# Altium schematic sheet Sheet2.SchDoc
size A3; DocumentNumber: 2; SheetNumber: 2; SheetTotal: 2
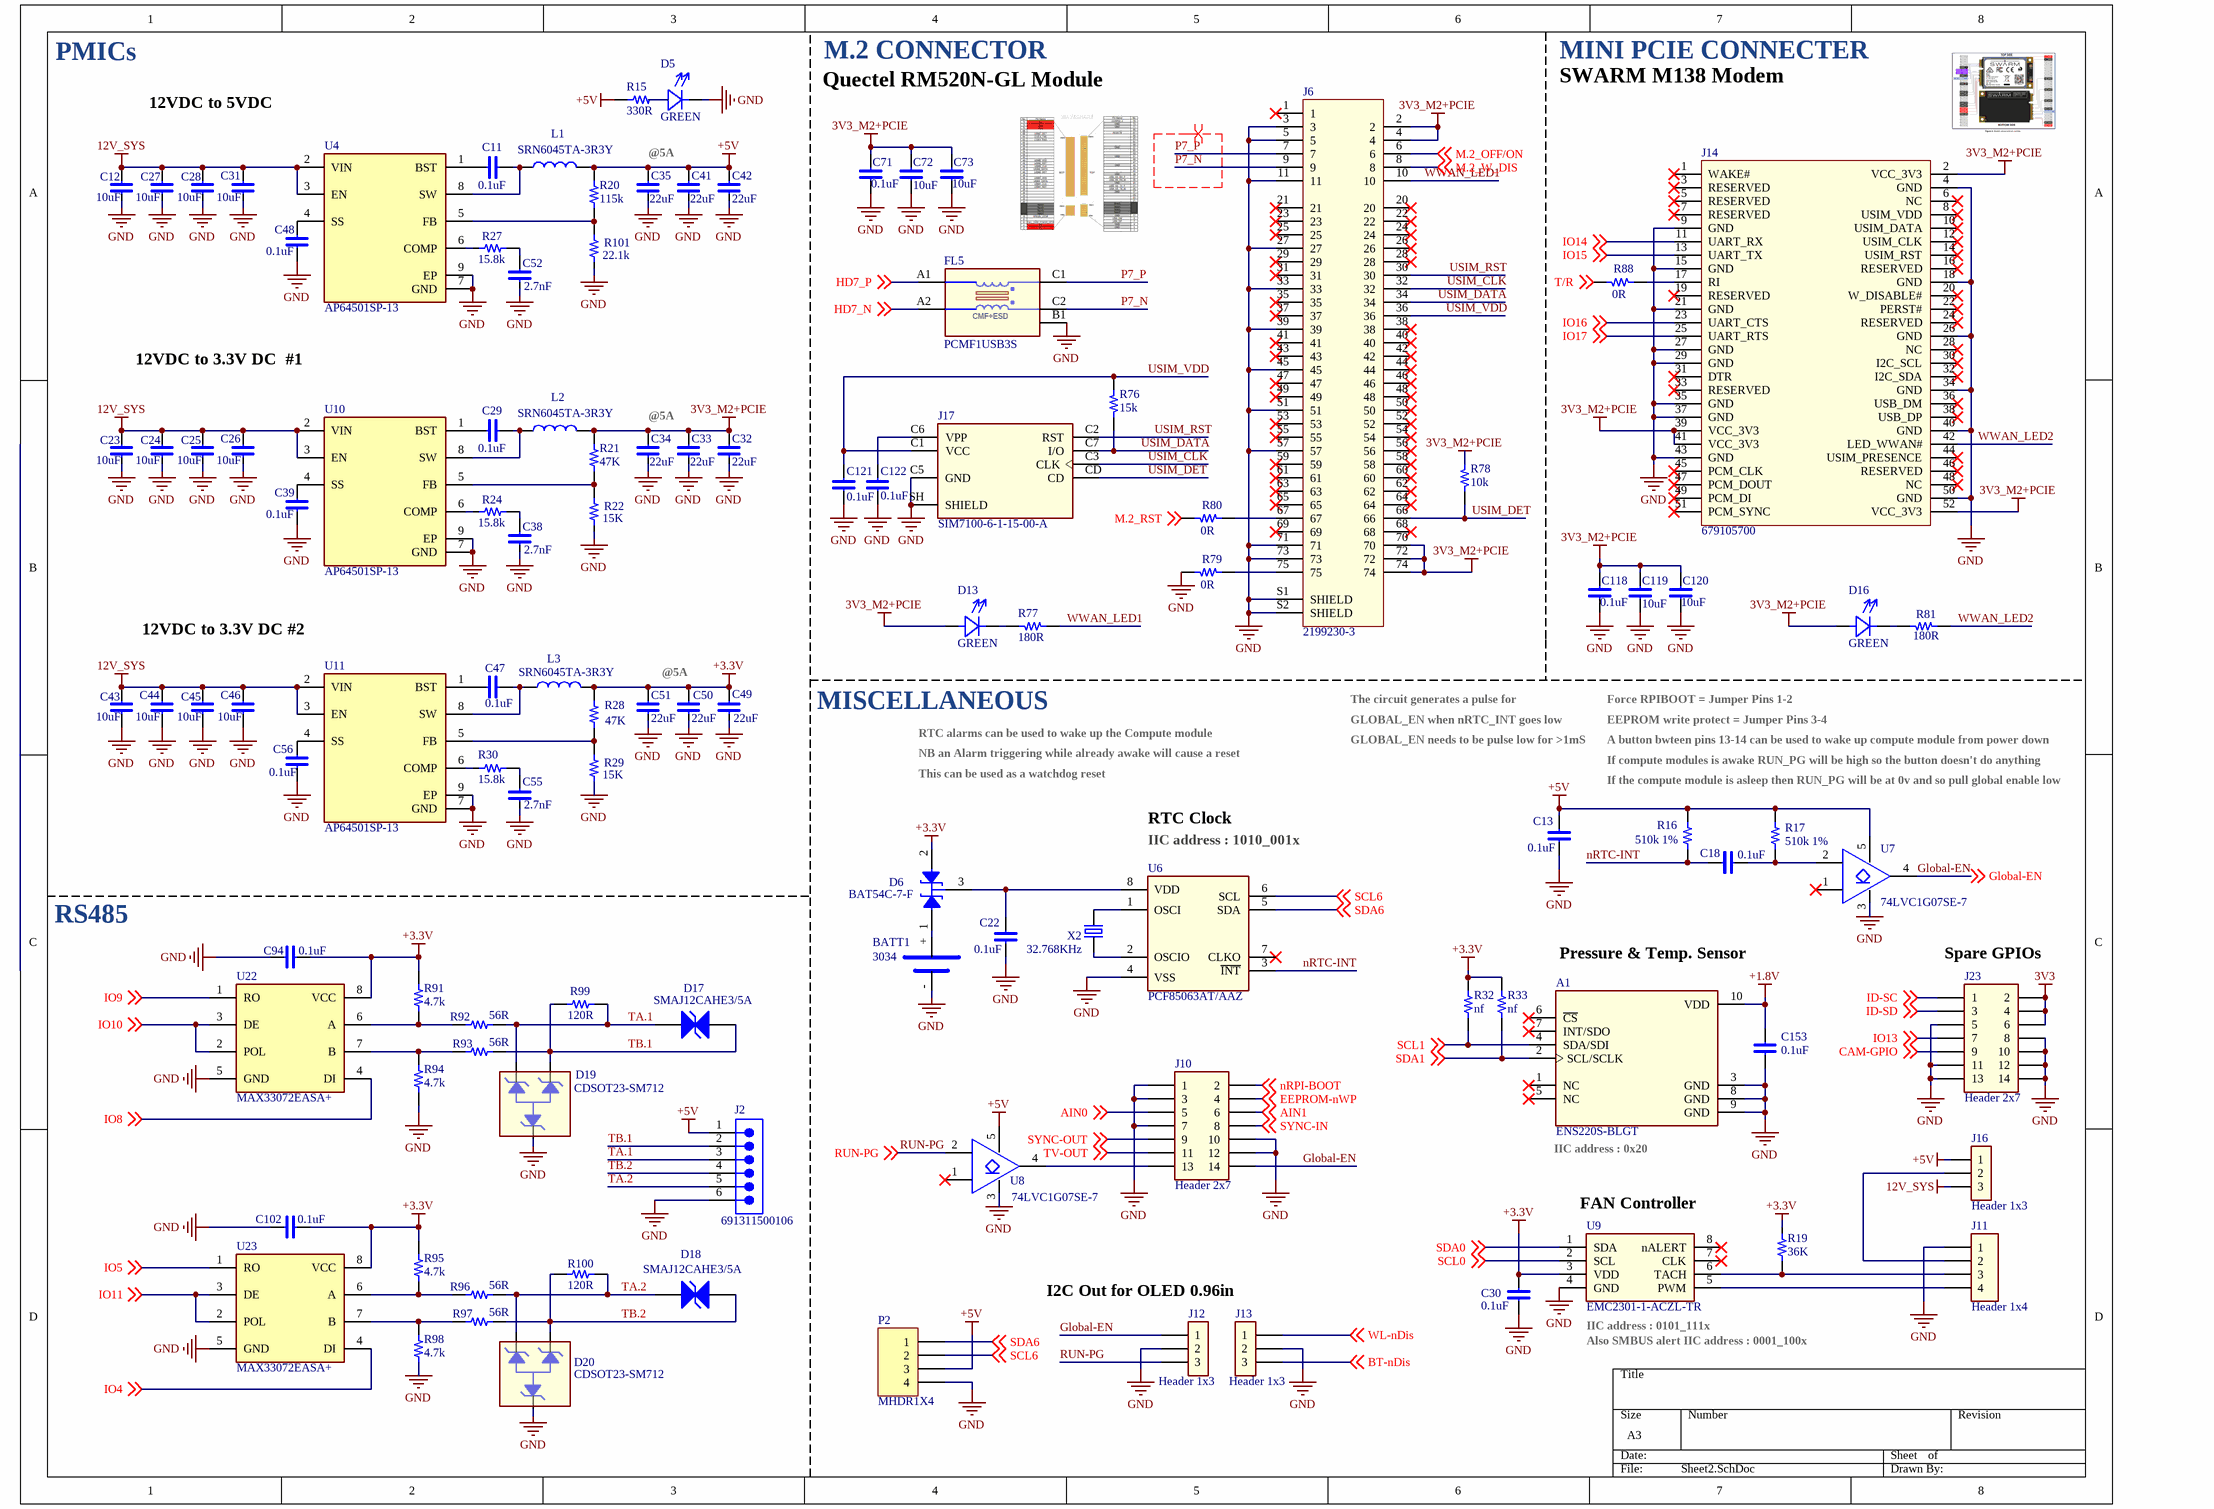
[diagram p0: Sheet2.SchDoc]

## Parts
A1  ENS220S-BLGT  [XDCR_ENS220S-BLGT]
BATT1  3034  [Keystone-3034]
C11  0.1uF  [C-0402/1005]
C12  10uF  [C-0805/2012]
C13  0.1uF  [C-0402/1005]
C18  0.1uF  [C-0402/1005]
C22  0.1uF  [C-0402/1005]
C23  10uF  [C-0805/2012]
C24  10uF  [C-0805/2012]
C25  10uF  [C-0805/2012]
C26  10uF  [C-0805/2012]
C27  10uF  [C-0805/2012]
C28  10uF  [C-0805/2012]
C29  0.1uF  [C-0402/1005]
C30  0.1uF  [C-0402/1005]
C31  10uF  [C-0805/2012]
C32  22uF  [C-0805/2012]
C33  22uF  [C-0805/2012]
C34  22uF  [C-0805/2012]
C35  22uF  [C-0805/2012]
C38  2.7nF  [C-0402/1005]
C39  0.1uF  [C-0402/1005]
C41  22uF  [C-0805/2012]
C42  22uF  [C-0805/2012]
C43  10uF  [C-0805/2012]
C44  10uF  [C-0805/2012]
C45  10uF  [C-0805/2012]
C46  10uF  [C-0805/2012]
C47  0.1uF  [C-0402/1005]
C48  0.1uF  [C-0402/1005]
C49  22uF  [C-0805/2012]
C50  22uF  [C-0805/2012]
C51  22uF  [C-0805/2012]
C52  2.7nF  [C-0402/1005]
C55  2.7nF  [C-0402/1005]
C56  0.1uF  [C-0402/1005]
C71  0.1uF  [C-0402/1005]
C72  10uF  [C-0603/1608]
C73  10uF  [C-0603/1608]
C94  0.1uF  [C-0402/1005]
C102  0.1uF  [C-0402/1005]
C118  0.1uF  [C-0402/1005]
C119  10uF  [C-0603/1608]
C120  10uF  [C-0603/1608]
C121  0.1uF  [C-0402/1005]
C122  0.1uF  [C-0402/1005]
C153  0.1uF  [C-0402/1005]
D5  GREEN  [LED-0603-Green]
D6  BAT54C-7-F  [SOT-23-3]
D13  GREEN  [LED-0402-GREEN]
D16  GREEN  [LED-0402-GREEN]
D17  SMAJ12CAHE3/5A  [VISH-DO-214AC-2_L]
D18  SMAJ12CAHE3/5A  [VISH-DO-214AC-2_L]
D19  CDSOT23-SM712  [SOT-23-3]
D20  CDSOT23-SM712  [SOT-23-3]
FL5  PCMF1USB3S  [WLCSP5(2-1-2)_NEX]
J2  691311500106  [691311500106]
J6  2199230-3  [TE_2199230-3]
J10  Header 2x7  [PIN HEADER 2x7 2.54mm]
J11  Header 1x4  [PIN HEADER 1x4 2.54mm]
J12  Header 1x3  [PIN HEADER 1x3 2.54mm]
J13  Header 1x3  [PIN HEADER 1x3 2.54mm]
J14  679105700  [679105700-A]
J16  Header 1x3  [PIN HEADER 1x3 2.54mm]
J17  SIM7100-6-1-15-00-A  [GCT_SIM7100-6-1-15-00-A_REVC]
J23  Header 2x7  [PIN HEADER 2x7 2.54mm]
L1  SRN6045TA-3R3Y  [IND_SRN6045TA-3R3Y]
L2  SRN6045TA-3R3Y  [IND_SRN6045TA-3R3Y]
L3  SRN6045TA-3R3Y  [IND_SRN6045TA-3R3Y]
P2  MHDR1X4  [PIN HEADER 1x4 2.54mm]
R15  330R  [R-0402/1005]
R16  510k 1%  [R-0402/1005]
R17  510k 1%  [R-0402/1005]
R19  36K  [R-0402/1005]
R20  115k  [R-0402/1005]
R21  47K  [R-0402/1005]
R22  15K  [R-0402/1005]
R24  15.8k  [R-0402/1005]
R27  15.8k  [R-0402/1005]
R28  47K  [R-0402/1005]
R29  15K  [R-0402/1005]
R30  15.8k  [R-0402/1005]
R32  nf  [R-0402/1005]
R33  nf  [R-0402/1005]
R76  15k  [R-0402/1005]
R77  180R  [R-0402/1005]
R78  10k  [R-0402/1005]
R79  0R  [R-0402/1005]
R80  0R  [R-0402/1005]
R81  180R  [R-0402/1005]
R88  0R  [R-0402/1005]
R91  4.7k  [R-0402/1005]
R92  56R  [R-0402/1005]
R93  56R  [R-0402/1005]
R94  4.7k  [R-0402/1005]
R95  4.7k  [R-0402/1005]
R96  56R  [R-0402/1005]
R97  56R  [R-0402/1005]
R98  4.7k  [R-0402/1005]
R99  120R  [R-0402/1005]
R100  120R  [R-0402/1005]
R101  22.1k  [R-0402/1005]
U4  AP64501SP-13  [FP-SO-8EP-IPC_A]
U6  PCF85063AT/AAZ  [SOIC-8 (W3.9mm)]
U7  74LVC1G07SE-7  [SOT-353]
U8  74LVC1G07SE-7  [SOT-353]
U9  EMC2301-1-ACZL-TR  [SOP65P490X110-8N]
U10  AP64501SP-13  [FP-SO-8EP-IPC_A]
U11  AP64501SP-13  [FP-SO-8EP-IPC_A]
U22  MAX33072EASA+  [FP-S8-4-IPC_B]
U23  MAX33072EASA+  [FP-S8-4-IPC_B]
X2  32.768KHz  [XTAL3215]

## Nets
3V3: J23.2 J23.4 J23.6
3V3_M2+PCIE: C32.1 C33.1 C34.1 C71.1 C72.1 C73.1 C118.1 C119.1 C120.1 D13.1(A) D16.1(A) J6.2 J6.4 J6.70 J6.72 J6.74 J14.2(VCC_3V3) J14.39(VCC_3V3) J14.41(VCC_3V3) J14.52(VCC_3V3) L2.1 R21.1 R78.2
12V_SYS: C12.1 C23.1 C24.1 C25.1 C26.1 C27.1 C28.1 C31.1 C43.1 C44.1 C45.1 C46.1 J16.3 U4.2(VIN) U4.3(EN) U10.2(VIN) U10.3(EN) U11.2(VIN) U11.3(EN)
+1.8V: A1.10(VDD) C153.1
+3.3V: C30.1 C49.1 C50.1 C51.1 C94.2 C102.2 D6.2 L3.1 R19.1 R28.1 R32.1 R33.1 R91.2 R95.2 U9.3(VDD) U22.8(VCC) U23.8(VCC)
+5V: C13.1 C35.1 C41.1 C42.1 J2.1 J16.1 L1.1 P2.3 R15.2 R16.2 R17.2 R20.1 U7.5 U8.5
GND: A1.3(GND) A1.8(GND) A1.9(GND) BATT1.-(_) C12.2 C13.2 C22.2 C23.2 C24.2 C25.2 C26.2 C27.2 C28.2 C30.2 C31.2 C32.2 C33.2 C34.2 C35.2 C38.2 C39.2 C41.2 C42.2 C43.2 C44.2 C45.2 C46.2 C48.2 C49.2 C50.2 C51.2 C52.2 C55.2 C56.2 C71.2 C72.2 C73.2 C94.1 C102.1 C118.2 C119.2 C120.2 C121.2 C122.2 C153.2 D5.2 D19.3 D20.3 FL5.B1(GND) J2.6 J6.3 J6.5 J6.11 J6.27 J6.33 J6.39 J6.45 J6.51 J6.57 J6.71 J6.73 J6.S1(SHIELD) J6.S2(SHIELD) J10.1 J10.3 J10.7 J10.10 J10.12 J11.1 J12.2 J13.2 J14.4(GND) J14.9(GND) J14.15(GND) J14.18(GND) J14.21(GND) J14.26(GND) J14.27(GND) J14.29(GND) J14.34(GND) J14.35(GND) J14.37(GND) J14.40(GND) J14.43(GND) J14.50(GND) J17.C5(GND) J17.SH(SHIELD) J23.5 J23.8 J23.10 J23.11 J23.12 J23.13 J23.14 P2.4 R22.2 R29.2 R79.2 R94.2 R98.2 R101.2 U4.7(GND) U4.9(EP) U6.4(VSS) U7.3 U8.3 U9.4(GND) U10.7(GND) U10.9(EP) U11.7(GND) U11.9(EP) U22.5(GND) U23.5(GND)
AIN0: J10.5 ; off-sheet AIN0
AIN1: J10.6 ; off-sheet AIN1
BT-nDis: J13.3 ; off-sheet BT-nDis
CAM-GPIO: J23.9 ; off-sheet CAM-GPIO
EEPROM-nWP: J10.4 ; off-sheet EEPROM-nWP
Global-EN: J10.14 J12.1 U7.4 ; off-sheet Global-EN
HD7_N: FL5.A2(CH1_IN-) ; off-sheet HD7_N
HD7_P: FL5.A1(CH1_IN+) ; off-sheet HD7_P
ID-SC: J23.1 ; off-sheet ID-SC
ID-SD: J23.3 ; off-sheet ID-SD
IO4: U23.4(DI) ; off-sheet IO4
IO5: U23.1(RO) ; off-sheet IO5
IO8: U22.4(DI) ; off-sheet IO8
IO9: U22.1(RO) ; off-sheet IO9
IO10: U22.2(POL) U22.3(DE) ; off-sheet IO10
IO11: U23.2(POL) U23.3(DE) ; off-sheet IO11
IO13: J23.7 ; off-sheet IO13
IO14: J14.11(UART_RX) ; off-sheet IO14
IO15: J14.13(UART_TX) ; off-sheet IO15
IO16: J14.23(UART_CTS) ; off-sheet IO16
IO17: J14.25(UART_RTS) ; off-sheet IO17
M.2_OFF/ON: J6.6 ; off-sheet M.2_OFF/ON
M.2_RST: R80.2 ; off-sheet M.2_RST
M.2_W_DIS: J6.8 ; off-sheet M.2_W_DIS
nRPI-BOOT: J10.2 ; off-sheet nRPI-BOOT
nRTC-INT: C18.1 R16.1 U6.3(~{INT})
P7_N: FL5.C2(CH1_OUT-) J6.9
P7_P: FL5.C1(CH1_OUT+) J6.7
RUN-PG: J12.3 U8.2 ; off-sheet RUN-PG
SCL0: U9.2(SCL) ; off-sheet SCL0
SCL1: A1.4(SDA/SDI) R32.2 ; off-sheet SCL1
SCL6: P2.2 U6.6(SCL) ; off-sheet SCL6
SDA0: U9.1(SDA) ; off-sheet SDA0
SDA1: A1.2(SCL/SCLK) R33.2 ; off-sheet SDA1
SDA6: P2.1 U6.5(SDA) ; off-sheet SDA6
SYNC-IN: J10.8 ; off-sheet SYNC-IN
SYNC-OUT: J10.9 ; off-sheet SYNC-OUT
T/R: R88.2 ; off-sheet T/R
TA.1: D17.1(A1) D19.1 J2.3 R92.2 R99.1
TA.2: D18.1(A1) D20.1 J2.5 R96.2 R100.1
TB.1: D17.2(A2) D19.2 J2.2 R93.2 R99.2
TB.2: D18.2(A2) D20.2 J2.4 R97.2 R100.2
TV-OUT: J10.11 ; off-sheet TV-OUT
USIM_CLK: J6.32 J17.C3(CLK)
USIM_DATA: J6.34 J17.C7(I/O) R76.1
USIM_DET: J6.66 J17.CD R78.1
USIM_RST: J6.30 J17.C2(RST)
USIM_VDD: C121.1 J6.36 J17.C1(VCC) R76.2
WL-nDis: J13.1 ; off-sheet WL-nDis
WWAN_LED1: J6.10 R77.1
WWAN_LED2: J14.42(LED_WWAN#) R81.1
NetBATT1_+: BATT1.+ D6.1
NetC11_1: C11.1 L1.2 U4.8(SW)
NetC11_2: C11.2 U4.1(BST)
NetC18_2: C18.2 R17.1 U7.2
NetC22_1: C22.1 D6.3 U6.8(VDD)
NetC29_1: C29.1 L2.2 U10.8(SW)
NetC29_2: C29.2 U10.1(BST)
NetC38_1: C38.1 R24.2
NetC39_1: C39.1 U10.4(SS)
NetC47_1: C47.1 L3.2 U11.8(SW)
NetC47_2: C47.2 U11.1(BST)
NetC48_1: C48.1 U4.4(SS)
NetC52_1: C52.1 R27.2
NetC55_1: C55.1 R30.2
NetC56_1: C56.1 U11.4(SS)
NetC122_1: C122.1 J17.C6(VPP)
NetD5_1: D5.1 R15.1
NetD13_2: D13.2(C) R77.2
NetD16_2: D16.2(C) R81.2
NetJ6_67: J6.67 R80.1
NetJ6_75: J6.75 R79.1
NetJ10_13: J10.13 U8.4
NetJ11_2: J11.2 J16.2
NetJ11_3: J11.3 R19.2 U9.6(TACH)
NetJ11_4: J11.4 U9.5(PWM)
NetJ14_17: J14.17(RI) R88.1
NetR20_2: R20.2 R101.1 U4.5(FB)
NetR21_2: R21.2 R22.1 U10.5(FB)
NetR24_1: R24.1 U10.6(COMP)
NetR27_1: R27.1 U4.6(COMP)
NetR28_2: R28.2 R29.1 U11.5(FB)
NetR30_1: R30.1 U11.6(COMP)
NetR91_1: R91.1 R92.1 U22.6(A)
NetR93_1: R93.1 R94.1 U22.7(B)
NetR95_1: R95.1 R96.1 U23.6(A)
NetR97_1: R97.1 R98.1 U23.7(B)
NetU6_1: U6.1(OSCI) X2.2
NetU6_2: U6.2(OSCIO) X2.1

Not connected (* = marked no-connect by the designer): A1 1(NC)* 5(NC)* 6(~{CS})* 7(INT/SDO)*; J6 1* 20* 21* 22* 23* 24* 25* 26* 28* 29* 31* 35* 37* 38* 40* 41* 42* 43* 44* 46* 47* 48* 49* 50* 52* 53* 54* 55* 56* 58* 59* 60* 61* 62* 63* 64* 65* 68* 69*; J14 1(WAKE#)* 3(RESERVED)* 5(RESERVED)* 6(NC)* 7(RESERVED)* 8(USIM_VDD)* 10(USIM_DATA)* 12(USIM_CLK)* 14(USIM_RST)* 16(RESERVED)* 19(RESERVED)* 20(W_DISABLE#)* 22(PERST#)* 24(RESERVED)* 28(NC)* 30(I2C_SCL)* 31(DTR)* 32(I2C_SDA)* 33(RESERVED)* 36(USB_DM)* 38(USB_DP)* 44(USIM_PRESENCE)* 45(PCM_CLK)* 46(RESERVED)* 47(PCM_DOUT)* 48(NC)* 49(PCM_DI)* 51(PCM_SYNC)*; U6 7(CLKO)*; U7 1*; U8 1*; U9 7(CLK)* 8(nALERT)*

## Layout directives
differential pair; differential pair class 90OHM: P7_N, P7_P

## Notes on the sheet
- PMICs
- 12VDC to 5VDC
- Quectel RM520N-GL Module
- M.2 CONNECTOR
- MINI PCIE CONNECTER
- SWARM M138 Modem
- @5A
- 12VDC to 3.3V DC  #1
- 12VDC to 3.3V DC #2
- MISCELLANEOUS
- The circuit generates a pulse for
- GLOBAL_EN when nRTC_INT goes low
- Force RPIBOOT = Jumper Pins 1-2
- EEPROM write protect = Jumper Pins 3-4
- RTC alarms can be used to wake up the Compute module
- NB an Alarm triggering while already awake will cause a reset
- This can be used as a watchdog reset
- GLOBAL_EN needs to be pulse low for >1mS
- A button bwteen pins 13-14 can be used to wake up compute module from power down
- If compute modules is awake RUN_PG will be high so the button doesn't do anything
- If the compute module is asleep then RUN_PG will be at 0v and so pull global enable low
- (near U6) IIC address : 1010_001x
- RTC Clock
- RS485
- Pressure & Temp. Sensor
- (near J23) Spare GPIOs
- (near A1) IIC address : 0x20
- (near U9) FAN Controller
- (near P2) I2C Out for OLED 0.96in
- (near U9) IIC address : 0101_111x
- Also SMBUS alert IIC address : 0001_100x
- (in symbol Nexperia, PCMF1USB3SZ) CMF+ESD

## Library data of the parts
A1 = ENS220S-BLGT: Board Mount Pressure Sensors ENS220S-BLGT LGA10 T&R 3K5 - Premium accuracy barometric pressureand temperature sensor for activitytracking and indoor navigation /localization; MF: ScioSense; SnapEDA_Link: https://www.snapeda.com/parts/ENS220S-BLGT/ScioSense/view-part/?ref=snap; Package: None; Value: *; MP: ENS220S-BLGT; Check_prices: https://www.snapeda.com/parts/ENS220S-BLGT/ScioSense/view-part/?ref=eda
BATT1 = Coin-Cell: BATTERY RETAINER COIN 20MM SMD; Unit Price (USD): 0.33; Mfr. Part No.: 3034; Supplier: Digikey Electronics; Supplier Part No.: 36-3034-ND
C11 C12 C23-C35 C38 C39 C41-C52 C55 C56 = CAP 1206/3216: CAP CER 10UF 25V X5R 1206; Mfr. Part No.: C1206C106M3PACTU; Unit Price (USD): 0.28; Supplier Part No.: 399-8153-1-ND; Supplier: Digikey Electronics
C13 C18 C22 C121 C122 C153 = Capacitor-NonPolar: CAP CER 0.1UF 16V X7R 0402; Mfr. Part No.: GCM155R71C104KA55D; Unit Price (USD): 0.1; Value: 0.1uF 16V; Supplier Part No.: 490-4759-1-ND; Supplier: Digikey Electronics
C71-C73 C94 C102 C118-C120 = Capacitor-NonPolar: CAP CER 0.1UF 50V X7R 0402; Mfr. Part No.: UMK105B7104KV-FR; Value: 100nF; Unit Price (USD): 0.15; Supplier Part No.: 587-3498-1-ND; Supplier: Digikey Electronics
D5 D13 D16 = Diode-LED: Supplier: Digikey Electronics
D6 = BAT54C-7-F: DIODE ARRAY SCHOTTKY 30V SOT23-3; Unit Price (USD): 0.18; Supplier Part No.: BAT54C-FDICT-ND; Mfr. Part No.: BAT54C-7-F; Supplier: Digikey Electronics
D17 D18 = CMP-0548-00111-2: Transient Voltage Suppressor, 6.40 to 231 V, 12 V Stand-off Voltage, Bi-Directional, -55 to 155 degC, 2-pin DO-214AC, Pb-Free, Tape and Reel; Manufacturer: Vishay Semiconductor; ID (uA): 2; IFSM: 40 A; VBR Bi-Directional (V): 6.4 to 231; VWM (V): 12; PPPM (W): 400, 300; ComponentLink1Description: Manufacturer URL; ComponentLink3Description: Package Specification; ComponentLink3URL: http://www.vishay.com/docs/88390/smaj50a.pdf; RoHS: TRUE; PackageDescription: 2-Pin DO-214AC (SMA), Body 4.245 x 2.665 mm; Packing: Tape and Reel; Operating Junction and Storage Temperature Range: -55 to 150 degC; ComponentLink2Description: Datasheet; PartNumber: SMAJ12CAHE3/5A; PackageReference: DO-214AC-2; ComponentLink2URL: http://www.vishay.com/docs/88390/smaj50a.pdf; DatasheetVersion: 12/8/2013; Mounting Technology: Surface Mount; ComponentLink1URL: http://www.vishay.com/
D19 D20 = RCLAMP3552T: TVS DIODE 3.5V 6.5V SLP1006N3T; Mfr. Part No.: RCLAMP3552T.TNT; Unit Price (USD): 0.48; Supplier Part No.: RCLAMP3552T.TNTCT-ND; Supplier: Digikey Electronics
FL5 = Nexperia, PCMF1USB3SZ: FLT, SMT, WLCSP5, Common Mode EMI Filters; Supply Voltage: NO; Notes: NC; Value: PCMF1USB3S; Manufacturer: Nexperia; Mounting: SMT; Operating Temperature: -40ºC ~ +125ºC; Subpart Type: Common Mode EMI Filters; Footprint: WLCSP5; Manufacturer Part Number: PCMF1USB3S; Datasheet Link: https://www.nexperia.com/products/esd-protection-tvs-filtering-and-signal-conditioning/emi-solutions-with-integrated-protection/common-mode-filters-with-integrated-protection/PCMF1USB3S.html; Supply Current: NO; Substitutes Allowed: NO; Height: 0.6mm
J2 = CMP-1502-02150-2: NexarPartId: 8917751; Gender: Male; Number of Contacts: 6; Number of Levels: 1; Pitch: 5.08mm; Current: 20A; Voltage: 300V; RoHS: Compliant; Height: 12mm; Termination: Solder; Packaging: Box; Orientation: Vertical; Lead Pitch: 5.08mm; Mount: Through Hole; Length: 8.5mm; Contact Plating: Tin; Number of Rows: 1; Width: 32.48mm; Contact Material: Brass; Number of Pins: 6; Color: Green; Number of Positions Per Level: 6; REACH SVHC: Unknown
J6 = 2199230-3: M.2 0.5PITCH 4.2H KEY B 15U'' AU; Package: None; MP: 2199230-3; Value: *; Availability: Unavailable; Price: None
J10 J23 = Header 2x7: CONN HEADER VERT 14POS 2.54MM; Mfr. Part No.: PRPC007DFBN-RC; Unit Price (USD): 0.47; Supplier Part No.: S2221EC-07-ND; Supplier: Digikey Electronics
J11 = Header 1x4: CONN HEADER VERT 4POS 2.54MM; Supplier: Digikey Electronics
J12 J13 J16 = Header 1x3: CONN HEADER VERT 3POS 2.54MM; Mfr. Part No.: 75160-156-03LF; Value: 51R; Unit Price (USD): 0.74; Supplier Part No.: 609-75160-156-03LF-ND; Supplier: Digikey Electronics
J14 U9 = Component_1
J17 = SIM7100-6-1-15-00-A_REVC: 7 _6 + 1_ Position Card Connector Micro SIM Surface Mount, Right Angle Gold; MF: Global Connector Technology; Package: None; Availability: Unavailable; SnapEDA_Link: https://www.snapeda.com/parts/SIM7100-6-1-15-00-A/Global%20Connector%20Technology/view-part/449163/?ref=snap; MP: SIM7100-6-1-15-00-A; Price: None; Value: *
L1-L3 = 4.3x4.3mm: FIXED IND 22UH 620MA 350 MOHM; Mfr. Part No.: ASPI-4020S-220M-T; Unit Price (USD): 0.48; Supplier Part No.: 535-12307-1-ND; Value: 22uH; Supplier: Digikey Electronics
P2 = MHDR1X4: Header, 4-Pin; LatestRevisionDate: 17-Jul-2002; LatestRevisionNote: Re-released for DXP Platform.; Publisher: Altium Limited
R15 R19-R22 R24 R27-R30 R76-R81 R88 R91-R101 = Resistor: RES SMD 51 OHM 0.5% 1/16W 0402; Mfr. Part No.: ERA-2AED510X; Value: 51R; Unit Price (USD): 0.21; Supplier Part No.: P51DECT-ND; Supplier: Digikey Electronics
R16 R17 = Resistor: RES SMD 510K OHM 1% 1/16W 0402; Mfr. Part No.: MCR01MZPF5103; Unit Price (USD): 0.1; Value: 510k 1%; Supplier Part No.: RHM510KLCT-ND; Supplier: Digikey Electronics
R32 R33 = Resistor: RES SMD 1K OHM 1% 1/16W 0402; Mfr. Part No.: RC0402FR-071KL; Unit Price (USD): 0.1; Value: 1k; Supplier Part No.: 311-1.00KLRCT-ND; Supplier: Digikey Electronics
U4 U10 U11 = CMP-12757-000024-1: DCDC CONV HV BUCK SO-8EP
U6 = PCF85063AT/AAZ: IC RTC CLK/CALENDAR I2C 8SOIC; Unit Price (USD): 0.335; Mfr. Part No.: PCF85063AT/AAZ; Supplier Part No.: 568-PCF85063AT/AAZCT-ND; Supplier: Digikey Electronics
U7 U8 = 74LVC1G07SE-7: IC BUF NON-INVERT 5.5V SOT353; Unit Price (USD): 0.26; Mfr. Part No.: 74LVC1G07SE-7; Supplier Part No.: 74LVC1G07SE-7DICT-ND; Supplier: Digikey Electronics
U22 U23 = CMP-05679-000063-1: DUAL VOLTAGE RS-485, 70V FP, 40V
X2 = ST3215SB32768C0HPWBB: CRYSTAL 32.7680KHZ 7PF SMD 20ppm; Mfr. Part No.: CM7V-T1A-32.768KHZ-7PF-20PPM-TB-QA; Unit Price (USD): 0.42; Supplier: Digikey Electronics; Supplier Part No.: 2195-CM7V-T1A-32.768KHZ-7PF-20PPM-TB-QACT-ND